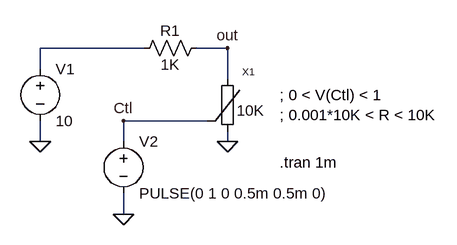
[diagram p0: schematic Test_Rctl.asc]
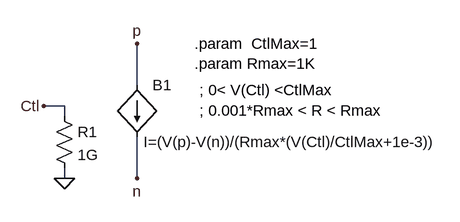
[diagram p1: sub-circuit rctl.asc]
Test_Rctl.asc, the LTspice schematic file:
Version 4
SHEET 1 880 680
WIRE 176 48 16 48
WIRE 304 48 256 48
WIRE 16 80 16 48
WIRE 304 96 304 48
WIRE 272 160 144 160
WIRE 16 192 16 160
WIRE 144 192 144 160
WIRE 304 192 304 176
WIRE 144 304 144 272
FLAG 16 192 0
FLAG 304 192 0
FLAG 144 304 0
FLAG 144 160 Ctl
FLAG 304 48 out
SYMBOL voltage 16 64 R0
WINDOW 123 0 0 Left 0
WINDOW 39 0 0 Left 0
SYMATTR InstName V1
SYMATTR Value 10
SYMBOL res 272 32 R90
WINDOW 0 5 56 VBottom 0
WINDOW 3 26 56 VTop 0
SYMATTR InstName R1
SYMATTR Value 1K
SYMBOL voltage 144 176 R0
WINDOW 123 0 0 Left 0
WINDOW 39 0 0 Left 0
SYMATTR InstName V2
SYMATTR Value PULSE(0 1 0 0.5m 0.5m 0)
SYMBOL Rctl 304 128 R0
SYMATTR Value2 10K
SYMATTR InstName X1
TEXT 384 224 Left 0 !.tran 1m
TEXT 384 120 Left 0 !; 0 < V(Ctl) < 1\n; 0.001*10K < R < 10K

rctl.asc, the sub-circuit schematic file:
Version 4
SHEET 1 880 680
WIRE 192 144 192 80
WIRE 80 176 48 176
WIRE 80 192 80 176
WIRE 80 288 80 272
WIRE 192 288 192 224
FLAG 80 288 0
FLAG 48 176 Ctl
FLAG 192 80 p
FLAG 192 288 n
SYMBOL bi 192 144 R0
WINDOW 3 10 88 Left 2
SYMATTR Value I=(V(p)-V(n))/(Rmax*(V(Ctl)/CtlMax+1e-3))
SYMATTR InstName B1
SYMBOL res 64 176 R0
SYMATTR InstName R1
SYMATTR Value 1G
TEXT 280 80 Left 2 !.param  CtlMax=1\n.param Rmax=1K
TEXT 288 152 Left 2 !; 0< V(Ctl) <CtlMax \n; 0.001*Rmax < R < Rmax

The netlist it stands for:
* Test_Rctl.asc
V1 N001 0 10
R1 out N001 1K
V2 Ctl 0 PULSE(0 1 0 0.5m 0.5m 0)
XX1 out 0 Ctl rctl params: Rmax= 10K

* block symbol definitions
.subckt rctl p n Ctl
B1 p n I=(V(p)-V(n))/(Rmax*(V(Ctl)/CtlMax+1e-3))
R1 Ctl 0 1G
.param  CtlMax=1
.param Rmax=1K
; 0< V(Ctl) <CtlMax
; 0.001*Rmax < R < Rmax
.ends rctl

.tran 1m
; 0 < V(Ctl) < 1
; 0.001*10K < R < 10K
.backanno
.end